# EAGLE schematic schematic (EAGLE 9.1.1)
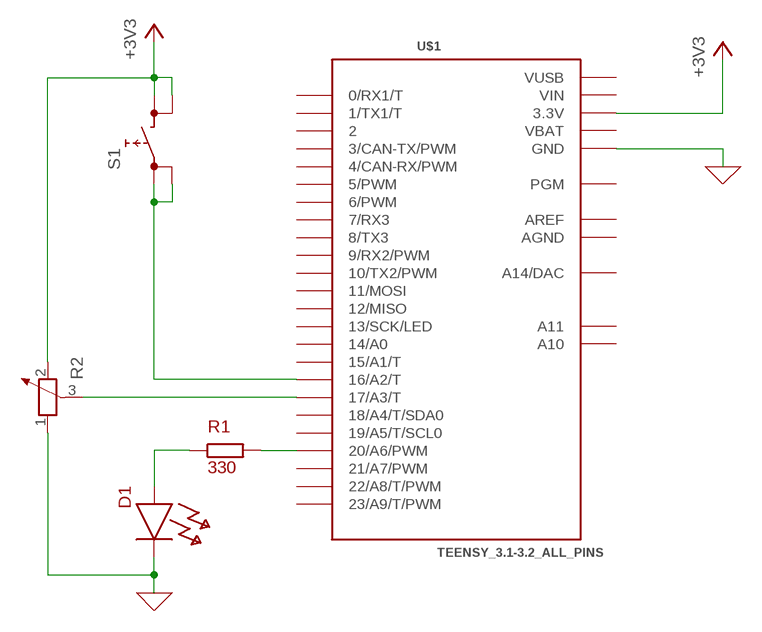
[diagram p0: schematic, sheet 1]

## Parts
D1  LED  (no package)
R1  330  R  (no package)
R2  POTENTIOMETER_PT-10  [PT-10]
S1  REKN  [REKN]
U$1  TEENSY_3.1-3.2_ALL_PINS  [TEENSY_3.0-3.2&LC_ALL_PINS]

## Nets
0: D1.C R2.1 U$1.GND U$1.GND1(GND) ; supply symbol labelled GND
+3V3: R2.2 S1.1A S1.1B U$1.3.3V U$1.3.3V1(3.3V)
N$2: S1.0A S1.0B U$1.16/A2(16/A2/T)
N$3: R2.3 U$1.17/A3(17/A3/T)
N$4: D1.A R1.1
N$8: R1.2 U$1.20/A6(20/A6/PWM)
Unconnected: U$1.0(0/RX1/T) U$1.1(1/TX1/T) U$1.2 U$1.3(3/CAN-TX/PWM) U$1.4(4/CAN-RX/PWM) U$1.5(5/PWM) U$1.6(6/PWM) U$1.7(7/RX3) U$1.8(8/TX3) U$1.9(9/RX2/PWM) U$1.10(10/TX2/PWM) U$1.11(11/MOSI) U$1.12(12/MISO) U$1.13(13/SCK/LED) U$1.14/A0 U$1.15/A1(15/A1/T) U$1.18/A4(18/A4/T/SDA0) U$1.19/A5(19/A5/T/SCL0) U$1.21/A7(21/A7/PWM) U$1.22/A8(22/A8/T/PWM) U$1.23/A9(23/A9/T/PWM) U$1.A10 U$1.A11 U$1.PGM U$1.RESET/DAC(A14/DAC)

## Power pins joined to a net without a drawn wire
AGND: U$1.AGND
AREF: U$1.AREF
VBAT: U$1.VBAT
VIN: U$1.VIN
VUSB: U$1.VUSB

## Library data of the parts
D1 = ngspice-simulation:LED: Diode
R1 = ngspice-simulation:R: RESISTOR
R2 = rcl:POTENTIOMETER_: Potentiometer; SPICEMODEL: POT; SPICEPREFIX: X
S1 = switch:REKN: PUSH SWITCH ITT-Cannon-Cannon
U$1 = Teensy_3_and_LC_Series_Boards_v1.4:TEENSY_3.1-3.2_ALL_PINS: Footprint for Teensy 3.1 or 3.2 board using all through-holes, i.e. the entire perimeter plus the 4 through-holes inboard (A10,A11,AREF, VUSB)